# Altium project 2228_AlarmeFenetre_Recepteur.PrjPcb
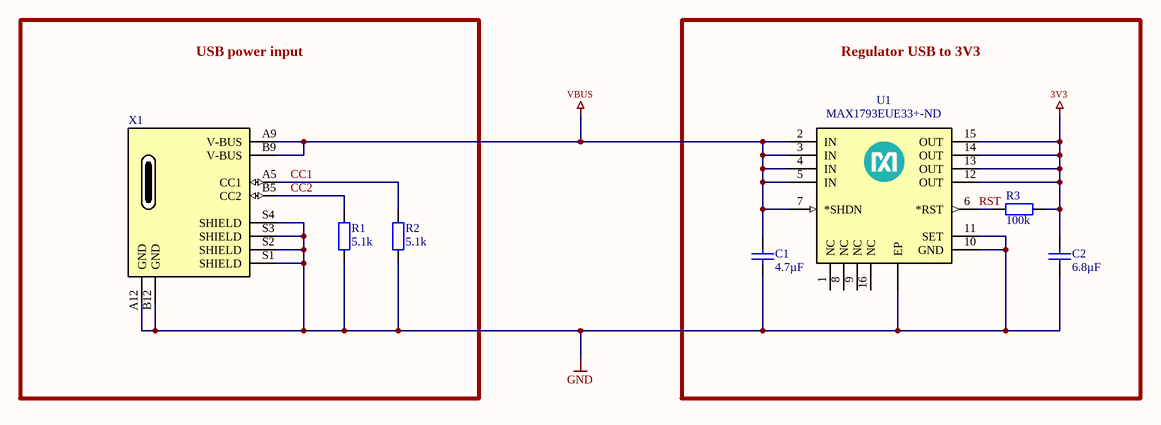
[diagram p0: 2228_Recepteur_Alimentation.SchDoc]
3 sheets, 29 parts. Net scope: global (net labels, ports and power ports of the same name join across sheets).
Board file: 22281A_AlarmeFenetre_Recepteur.PcbDoc
Sheets:
  2228_Recepteur_Alimentation.SchDoc
  2228_Recepteur_PIC32.SchDoc
  2228_Recepteur_MIKROE_NRF.SchDoc

## Sheet 2228_Recepteur_Alimentation.SchDoc
size A4; Author: Miguel Santos; Organization: ETML-ES; Address1: Avenue Recordon 1; Address2: 1004 Lausanne; Address3: Switzerland; Revision: B; SheetNumber: 1; SheetTotal: 3; Version: 1.0

### Parts
C1  value 4.7µF  [CAP_0805]  (hidden comment: CAP_SMD)
C2  value 6.8µF  [CAP_0805]  (hidden comment: CAP_SMD)
R1  value 5.1k  [RES_0805]  (hidden comment: RES_SMD)
R2  value 5.1k  [RES_0805]  (hidden comment: RES_SMD)
R3  value 100k  [RES_0805]  (hidden comment: RES_SMD)
U1  Supplier Part Number 1: MAX1793EUE33+-ND  [SOP65P638X110-17N]  (hidden comment: MAX1793EUE33+)
X1  UJC-HP-3-SMT-TR  [CUI_UJC-HP-3-SMT-TR]  (value not drawn)

### Blocks framed on the sheet
USB power input: R1 R2 X1
Regulator USB to 3V3: C1 C2 R3 U1

### Nets
3V3: C2.2 R3.2 U1.12(OUT) U1.13(OUT) U1.14(OUT) U1.15(OUT)
GND: C1.1 C2.1 R1.1 R2.1 U1.0(EP) U1.10(GND) U1.11(SET) X1.A12(GND) X1.B12(GND) X1.S1(SHIELD) X1.S2(SHIELD) X1.S3(SHIELD) X1.S4(SHIELD)
VBUS: C1.2 U1.2(IN) U1.3(IN) U1.4(IN) U1.5(IN) U1.7(*SHDN) X1.A9(V-BUS) X1.B9(V-BUS)
CC1: R2.2 X1.A5(CC1)
CC2: R1.2 X1.B5(CC2)
RST: R3.1 U1.6(*RST)

Not connected (* = marked no-connect by the designer): U1 1(NC) 8(NC) 9(NC) 16(NC)

### Notes on the sheet
- Fichier :
- a
- Date :
- Heure :
- Version :
- Auteur :
- Modif.
- b
- c
- d
- Projet :
- No :
- Nb feuilles
- Feuille n°
- Chemin :

### Library data of the parts
C1 C2 = CAP_SMD: Ceramic capacitor; Manufacturer: *; Manufacturer_Number: *
U1 = MAX1793: Supplier 1: Digi-Key
X1 = USB-C_CUI: Type C, 3 A, Right Angle, Surface Mount (SMT), Power-Only USB Receptacle; Manufacturer: CUI Devices; Manufacturer_Number: UJC-HP-3-SMT-TR
R1-R3 = RES_SMD: Manufacturer: *; Manufacturer_Number: *

## Sheet 2228_Recepteur_PIC32.SchDoc
size A4; Author: Miguel Santos; Organization: ETML-ES; Address1: Avenue Recordon 1; Address2: 1004 Lausanne; Address3: Switzerland; Revision: B; SheetNumber: 2; SheetTotal: 3; Version: 1.0
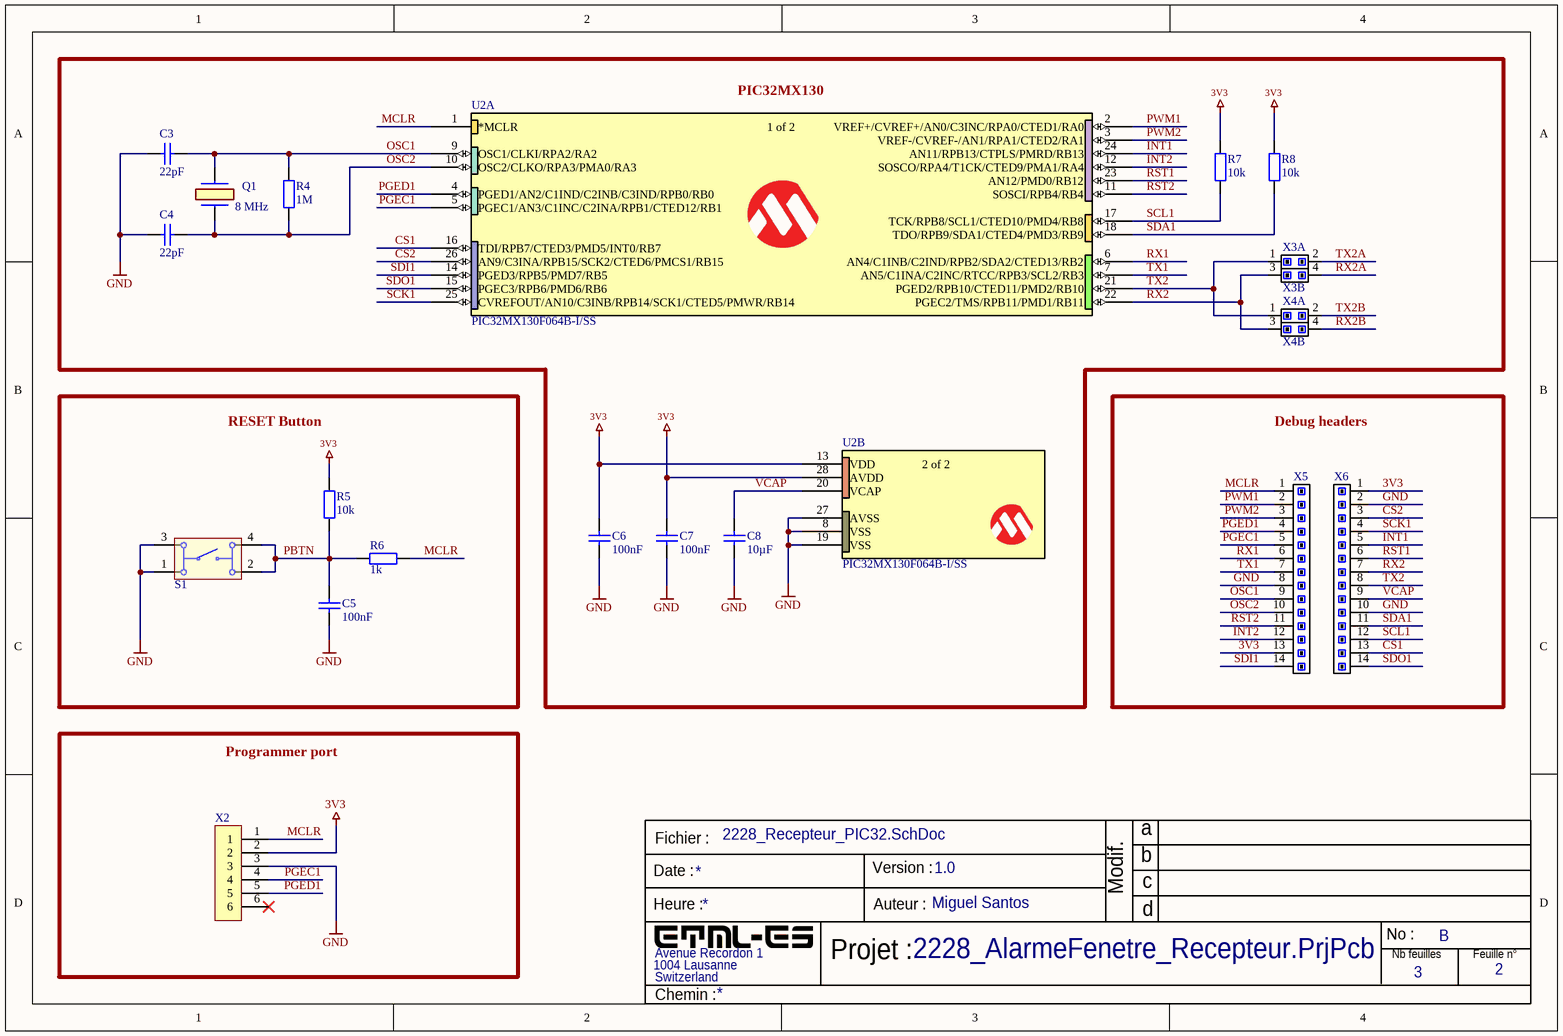
[diagram p1: 2228_Recepteur_PIC32.SchDoc]

### Parts
C3  value 22pF  [CAP_0805]  (hidden comment: CAP_SMD)
C4  value 22pF  [CAP_0805]  (hidden comment: CAP_SMD)
C5  value 100nF  [CAP_0805]  (hidden comment: CAP_SMD)
C6  value 100nF  [CAP_0805]  (hidden comment: CAP_SMD)
C7  value 100nF  [CAP_0805]  (hidden comment: CAP_SMD)
C8  value 10µF  [CAP_0805]  (hidden comment: CAP_SMD)
Q1  8 MHz  [LFXTAL003151]
R4  value 1M  [RES_0805]  (hidden comment: RES_SMD)
R5  value 10k  [RES_0805]  (hidden comment: RES_SMD)
R6  value 1k  [RES_0805]  (hidden comment: RES_SMD)
R7  value 10k  [RES_0805]  (hidden comment: RES_SMD)
R8  value 10k  [RES_0805]  (hidden comment: RES_SMD)
S1  430182043816  [430182043816]  (value not drawn)
U2  PIC32MX130F064B-I/SS  [SSOP28_MC_MCH-M]  (parts A,B of 2)
X2  6 pins Header  [HEADER_6PINS]  (value not drawn)
X3  2X2PIN_HEADER  [2x2_HEADER]  (value not drawn)  (parts A,B of 2)
X4  2X2PIN_HEADER  [2x2_HEADER]  (value not drawn)  (parts A,B of 2)
X5  14PIN_HEADER  [HEADER_14PINS]  (value not drawn)
X6  14PIN_HEADER  [HEADER_14PINS]  (value not drawn)

### Blocks framed on the sheet
PIC32MX130: C3 C4 C6-C8 Q1 R4 R7 R8 U2 X3 X4
RESET Button: C5 R5 R6 S1
Debug headers: X5 X6
Programmer port: X2

### Nets
3V3: C6.1 C7.1 R5.2 R7.2 R8.2 U2.13(VDD) U2.28(AVDD) X2.2 X5.13 X6.1
GND: C3.2 C4.1 C5.2 C6.2 C7.2 C8.2 S1.1 S1.3 U2.8(VSS) U2.19(VSS) U2.27(AVSS) X2.3 X5.8 X6.2 X6.10
CS1: U2.16(TDI/RPB7/CTED3/PMD5/INT0/RB7) X6.13
CS2: U2.26(AN9/C3INA/RPB15/SCK2/CTED6/PMCS1/RB15) X6.3
INT1: U2.24(AN11/RPB13/CTPLS/PMRD/RB13) X6.5
INT2: U2.12(SOSCO/RPA4/T1CK/CTED9/PMA1/RA4) X5.12
MCLR: R6.1 U2.1(*MCLR) X2.1 X5.1
OSC1: C3.1 Q1.1 R4.2 U2.9(OSC1/CLKI/RPA2/RA2) X5.9
OSC2: C4.2 Q1.2 R4.1 U2.10(OSC2/CLKO/RPA3/PMA0/RA3) X5.10
PBTN: C5.1 R5.1 R6.2 S1.2 S1.4
PGEC1: U2.5(PGEC1/AN3/C1INC/C2INA/RPB1/CTED12/RB1) X2.4 X5.5
PGED1: U2.4(PGED1/AN2/C1IND/C2INB/C3IND/RPB0/RB0) X2.5 X5.4
PWM1: U2.2(VREF+/CVREF+/AN0/C3INC/RPA0/CTED1/RA0) X5.2
PWM2: U2.3(VREF-/CVREF-/AN1/RPA1/CTED2/RA1) X5.3
RST1: U2.23(AN12/PMD0/RB12) X6.6
RST2: U2.11(SOSCI/RPB4/RB4) X5.11
RX1: U2.6(AN4/C1INB/C2IND/RPB2/SDA2/CTED13/RB2) X5.6
RX2: U2.22(PGEC2/TMS/RPB11/PMD1/RB11) X3.3 X4.3 X6.7
RX2A: X3.4
RX2B: X4.4
SCK1: U2.25(CVREFOUT/AN10/C3INB/RPB14/SCK1/CTED5/PMWR/RB14) X6.4
SCL1: R7.1 U2.17(TCK/RPB8/SCL1/CTED10/PMD4/RB8) X6.12
SDA1: R8.1 U2.18(TDO/RPB9/SDA1/CTED4/PMD3/RB9) X6.11
SDI1: U2.14(PGED3/RPB5/PMD7/RB5) X5.14
SDO1: U2.15(PGEC3/RPB6/PMD6/RB6) X6.14
TX1: U2.7(AN5/C1INA/C2INC/RTCC/RPB3/SCL2/RB3) X5.7
TX2: U2.21(PGED2/RPB10/CTED11/PMD2/RB10) X3.1 X4.1 X6.8
TX2A: X3.2
TX2B: X4.2
VCAP: C8.1 U2.20(VCAP) X6.9

Not connected (* = marked no-connect by the designer): X2 6*

### Notes on the sheet
- Fichier :
- a
- Date :
- Heure :
- Version :
- Auteur :
- Modif.
- b
- c
- d
- Projet :
- No :
- Nb feuilles
- Feuille n°
- Chemin :
- (in symbol PIC32MX130F064B-I/SS, part A) 1 of 2
- (in symbol PIC32MX130F064B-I/SS, part B) 2 of 2

### Library data of the parts
C3-C8 = CAP_SMD: Ceramic capacitor; Manufacturer: *; Manufacturer_Number: *
Q1 = LFXTAL003151: IQD FREQUENCY PRODUCTS - LFXTAL003151REEL - CRYSTAL, 8MHZ, 16PF, 11.4 X 4.9MM; Geometry.Height: 4.3mm; Manufacturer_Name: IQD; Manufacturer_Part_Number: LFXTAL003151REEL; Mouser Part Number: 449-LFXTAL003151REEL; Mouser Price/Stock: https://www.mouser.co.uk/ProductDetail/IQD/LFXTAL003151Reel?qs=e4%2FAndAAwgKt40cosvhepA%3D%3D; Arrow Part Number: LFXTAL003151REEL; Arrow Price/Stock: https://www.arrow.com/en/products/lfxtal003151reel/iqd-frequency-products?region=europe; Datasheet Link: https://www.iqdfrequencyproducts.com/products/pn/LFXTAL003151Reel.pdf
S1 = CMP-1452-00013-1: WS-TASV SMD Tact Switch 6X6 mm; Manufacturer: Wuerth Elektronik; NoPins: 04; ComponentLink2Description: Datasheet; PackageReference: 430182043816; ComponentLink2URL: http://katalog.we-online.de/em/datasheet/4301x2.pdf; ComponentLink1URL: http://www.we-online.com; PartNumber: 430182043816; ComponentLink1Description: Manufacturer URL
U2 = PIC32MX130F064B-I/SS: Manufacturer: Microchip; Manufacturer_Part_Number: PIC32MX130F064B-I/SS
R4-R8 = RES_SMD: Manufacturer: *; Manufacturer_Number: *

## Sheet 2228_Recepteur_MIKROE_NRF.SchDoc
size A4; Author: Miguel Santos; Organization: ETML-ES; Address1: Avenue Recordon 1; Address2: 1004 Lausanne; Address3: Switzerland; Revision: B; SheetNumber: 3; SheetTotal: 3; Version: 1.0
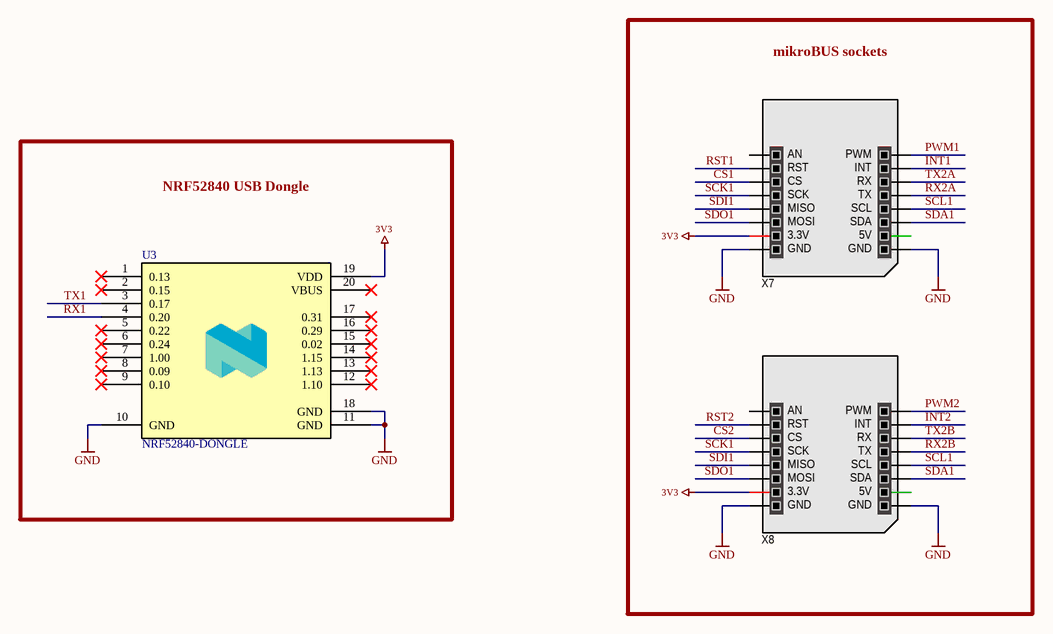
[diagram p2: 2228_Recepteur_MIKROE_NRF.SchDoc]

### Parts
U3  NRF52840-DONGLE  [NRF52840_DONGLE]
X7  MIKROBUS HOST CONN TH 16  [MIKROBUS HOST CONN. TH]  (value not drawn)
X8  MIKROBUS HOST CONN TH 16  [MIKROBUS HOST CONN. TH]  (value not drawn)

### Blocks framed on the sheet
mikroBUS sockets: X7 X8
NRF52840 USB Dongle: U3

### Nets
3V3: U3.19(VDD) X7.7(3.3V) X8.7(3.3V)
GND: U3.10(GND) U3.11(GND) U3.18(GND) X7.8(GND) X7.9(GND) X8.8(GND) X8.9(GND)
CS1: X7.3(CS)
CS2: X8.3(CS)
INT1: X7.15(INT)
INT2: X8.15(INT)
PWM1: X7.16(PWM)
PWM2: X8.16(PWM)
RST1: X7.2(RST)
RST2: X8.2(RST)
RX1: U3.4(0.20)
RX2A: X7.13(TX)
RX2B: X8.13(TX)
SCK1: X7.4(SCK) X8.4(SCK)
SCL1: X7.12(SCL) X8.12(SCL)
SDA1: X7.11(SDA) X8.11(SDA)
SDI1: X7.5(MISO) X8.5(MISO)
SDO1: X7.6(MOSI) X8.6(MOSI)
TX1: U3.3(0.17)
TX2A: X7.14(RX)
TX2B: X8.14(RX)

Not connected (* = marked no-connect by the designer): U3 1(0.13)* 2(0.15)* 5(0.22)* 6(0.24)* 7(1.00)* 8(0.09)* 9(0.10)* 12(1.10)* 13(1.13)* 14(1.15)* 15(0.02)* 16(0.29)* 17(0.31)* 20(VBUS)*; X7 1(AN) 10(5V); X8 1(AN) 10(5V)

### Notes on the sheet
- Fichier :
- a
- Date :
- Heure :
- Version :
- Auteur :
- Modif.
- b
- c
- d
- Projet :
- No :
- Nb feuilles
- Feuille n°
- Chemin :

### Library data of the parts
U3 = NRF52840-DONGLE: Manufacturer: Nordic Semiconductor; Manufacturer_Number: NRF52840-DONGLE
X7 X8 = MIKROBUS HOST CONN

## Nets that join several sheets
3V3: 2228_Recepteur_Alimentation (6 pins), 2228_Recepteur_PIC32 (10 pins), 2228_Recepteur_MIKROE_NRF (U3.19 X7.7 X8.7)
GND: 2228_Recepteur_Alimentation (13 pins), 2228_Recepteur_PIC32 (15 pins), 2228_Recepteur_MIKROE_NRF (7 pins)
CS1: 2228_Recepteur_PIC32 (U2.16 X6.13), 2228_Recepteur_MIKROE_NRF (X7.3)
CS2: 2228_Recepteur_PIC32 (U2.26 X6.3), 2228_Recepteur_MIKROE_NRF (X8.3)
INT1: 2228_Recepteur_PIC32 (U2.24 X6.5), 2228_Recepteur_MIKROE_NRF (X7.15)
INT2: 2228_Recepteur_PIC32 (U2.12 X5.12), 2228_Recepteur_MIKROE_NRF (X8.15)
PWM1: 2228_Recepteur_PIC32 (U2.2 X5.2), 2228_Recepteur_MIKROE_NRF (X7.16)
PWM2: 2228_Recepteur_PIC32 (U2.3 X5.3), 2228_Recepteur_MIKROE_NRF (X8.16)
RST1: 2228_Recepteur_PIC32 (U2.23 X6.6), 2228_Recepteur_MIKROE_NRF (X7.2)
RST2: 2228_Recepteur_PIC32 (U2.11 X5.11), 2228_Recepteur_MIKROE_NRF (X8.2)
RX1: 2228_Recepteur_PIC32 (U2.6 X5.6), 2228_Recepteur_MIKROE_NRF (U3.4)
RX2A: 2228_Recepteur_PIC32 (X3.4), 2228_Recepteur_MIKROE_NRF (X7.13)
RX2B: 2228_Recepteur_PIC32 (X4.4), 2228_Recepteur_MIKROE_NRF (X8.13)
SCK1: 2228_Recepteur_PIC32 (U2.25 X6.4), 2228_Recepteur_MIKROE_NRF (X7.4 X8.4)
SCL1: 2228_Recepteur_PIC32 (R7.1 U2.17 X6.12), 2228_Recepteur_MIKROE_NRF (X7.12 X8.12)
SDA1: 2228_Recepteur_PIC32 (R8.1 U2.18 X6.11), 2228_Recepteur_MIKROE_NRF (X7.11 X8.11)
SDI1: 2228_Recepteur_PIC32 (U2.14 X5.14), 2228_Recepteur_MIKROE_NRF (X7.5 X8.5)
SDO1: 2228_Recepteur_PIC32 (U2.15 X6.14), 2228_Recepteur_MIKROE_NRF (X7.6 X8.6)
TX1: 2228_Recepteur_PIC32 (U2.7 X5.7), 2228_Recepteur_MIKROE_NRF (U3.3)
TX2A: 2228_Recepteur_PIC32 (X3.2), 2228_Recepteur_MIKROE_NRF (X7.14)
TX2B: 2228_Recepteur_PIC32 (X4.2), 2228_Recepteur_MIKROE_NRF (X8.14)